# Altium schematic sheet BA-BUS ADDR.SchDoc: DATAPATHS
size A3; Date: .Date; Author: Jeremy King; CompanyName: King Technologies; DrawnBy: Jeremy King; Engineer: Jeremy King; Organization: King Technologies; Address1: 676 Mandan Ave,; Address2: Melbourne,; Address3: FL,; Address4: 32935; DocumentNumber: 1; Revision: 1; SheetNumber: 2; SheetTotal: 3; ProjectTitle: Siena; Time: .Time
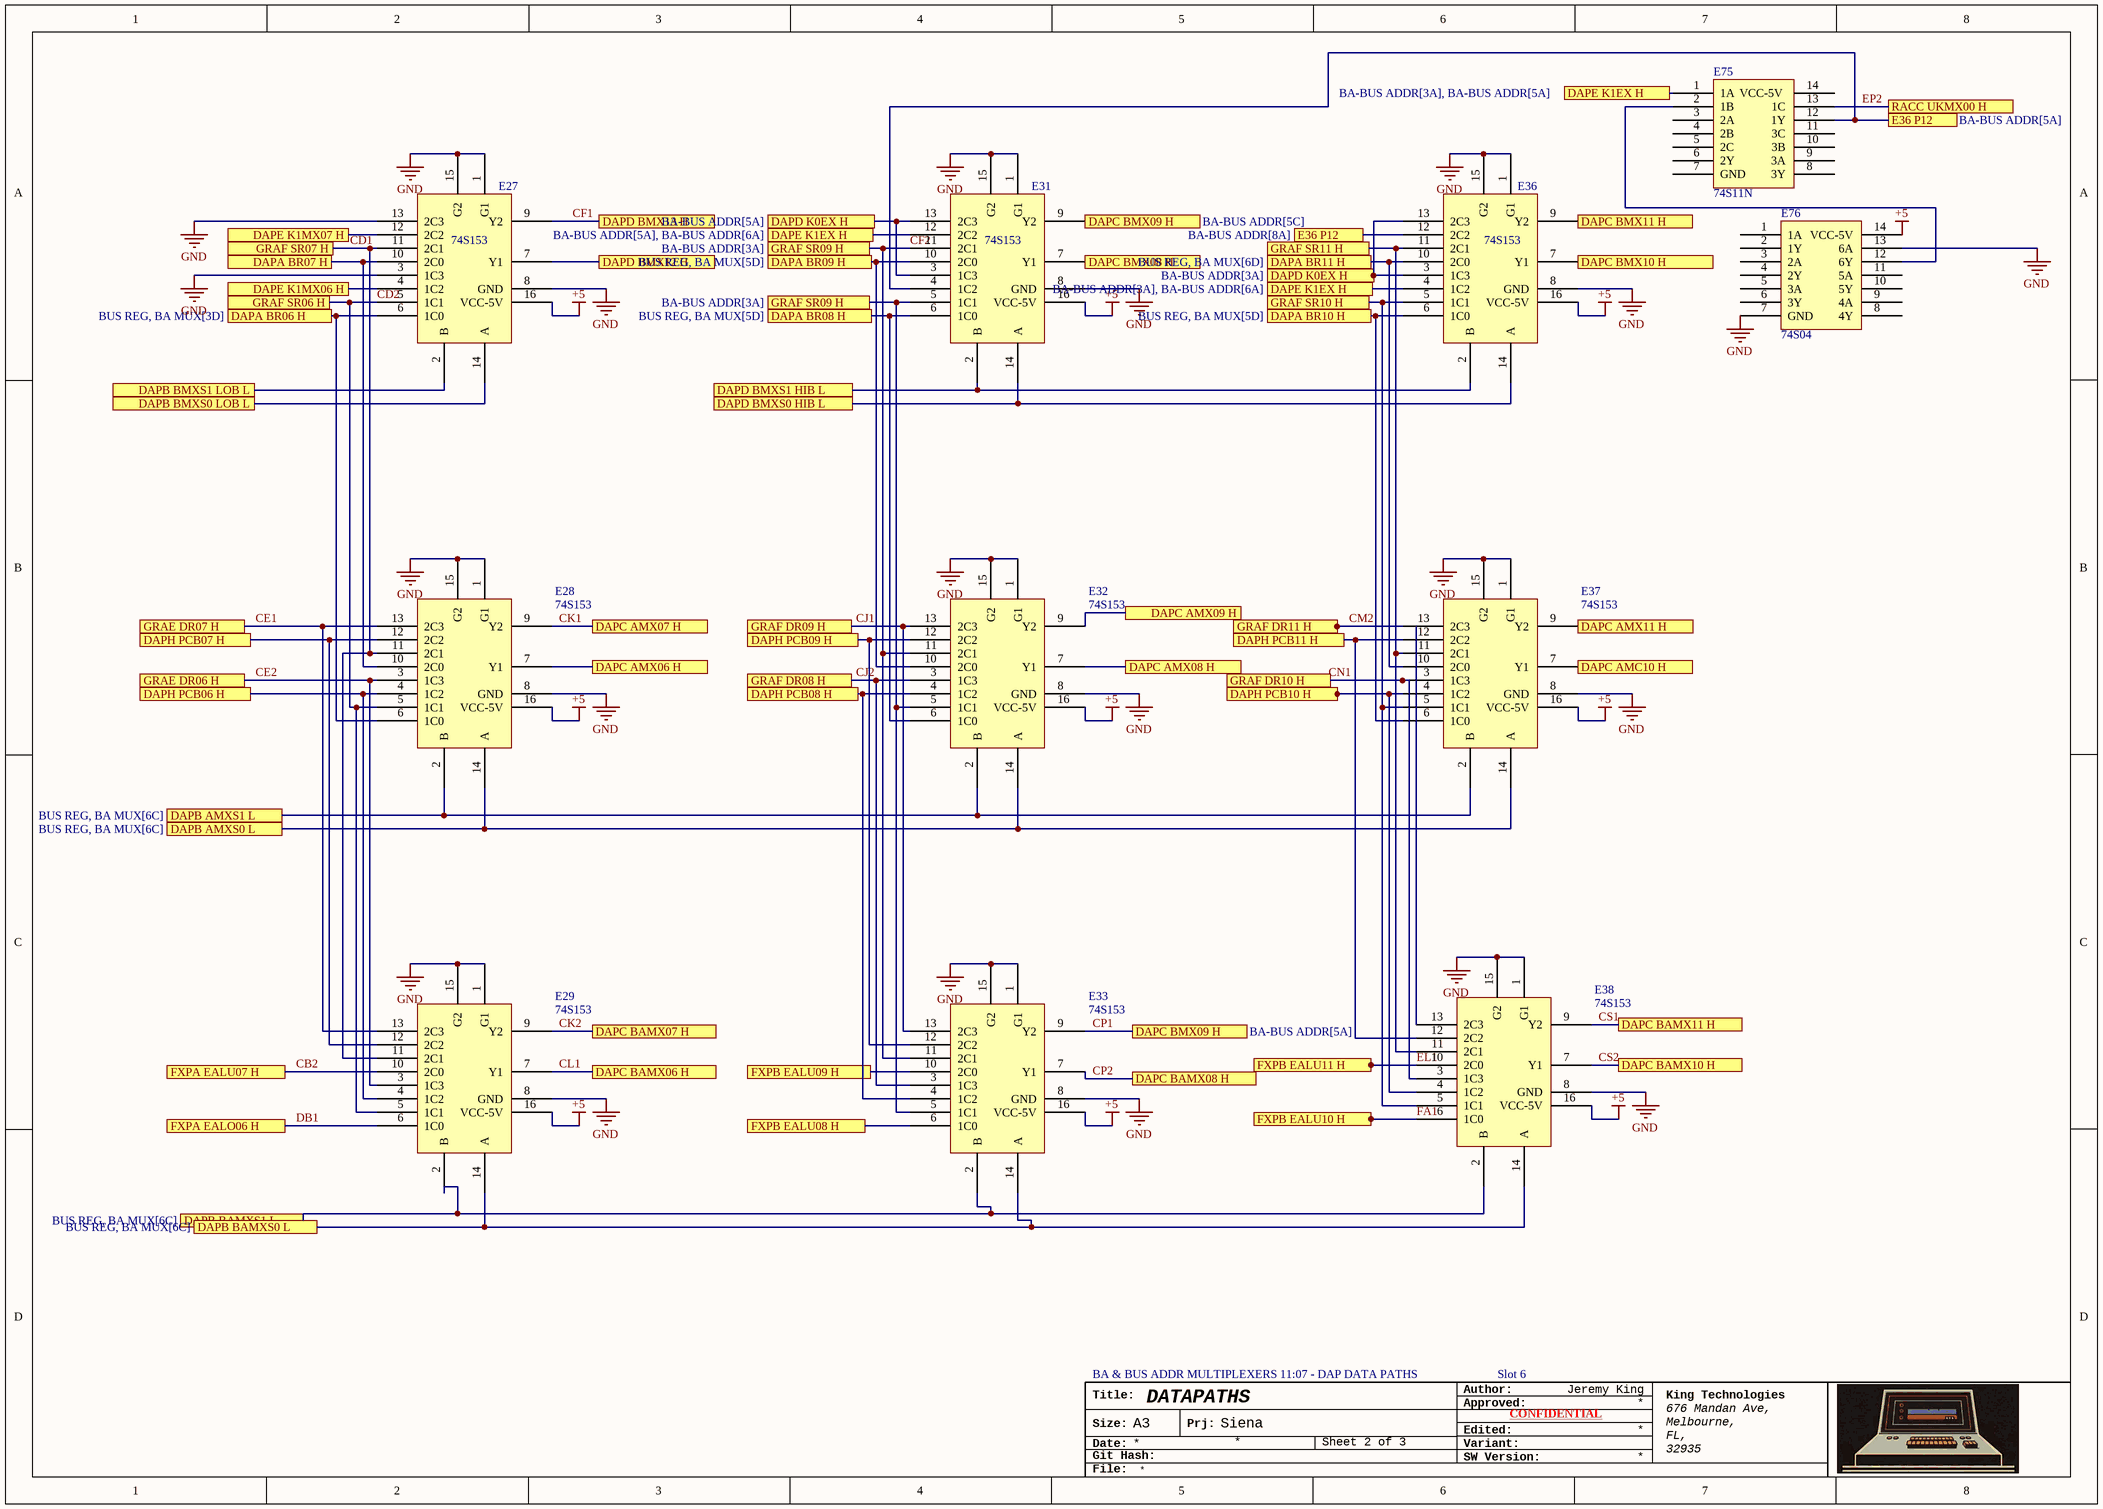
[diagram p0: BA-BUS ADDR.SchDoc]

## Parts
E27  74S153  [DIP16]
E28  74S153  [DIP16]
E29  74S153  [DIP16]
E31  74S153  [DIP16]
E32  74S153  [DIP16]
E33  74S153  [DIP16]
E36  74S153  [DIP16]
E37  74S153  [DIP16]
E38  74S153  [DIP16]
E75  74S11N  [DIP14]
E76  74S04  [DIP14]

## Ports
DAPA BR06 H (see BUS REG, BA MUX[3D]), DAPA BR07 H (see BUS REG, BA MUX[3D]), DAPA BR08 H (see BUS REG, BA MUX[5D]), DAPA BR09 H (see BUS REG, BA MUX[5D]), DAPA BR10 H (see BUS REG, BA MUX[5D]), DAPA BR11 H (see BUS REG, BA MUX[6D]), DAPB AMXS0 L (see BUS REG, BA MUX[6C]), DAPB AMXS1 L (see BUS REG, BA MUX[6C]), DAPB BAMXS0 L (see BUS REG, BA MUX[6C]), DAPB BAMXS1 L (see BUS REG, BA MUX[6C]), DAPB BMXS0 LOB L (see BUS REG, BA MUX[6B]), DAPB BMXS1 LOB L, DAPC AMC10 H, DAPC AMX06 H, DAPC AMX07 H, DAPC AMX08 H, DAPC AMX09 H, DAPC AMX11 H, DAPC BAMX06 H, DAPC BAMX07 H, DAPC BAMX08 H, DAPC BAMX10 H, DAPC BAMX11 H, DAPC BMX08 H, DAPC BMX09 H (see BA-BUS ADDR[5A]), DAPC BMX09 H (see BA-BUS ADDR[5C]), DAPC BMX10 H, DAPC BMX11 H, DAPD BMX12 H, DAPD BMX13 H, DAPD BMXS0 HIB L, DAPD BMXS1 HIB L, DAPD K0EX H (see BA-BUS ADDR[3A]), DAPD K0EX H (see BA-BUS ADDR[5A]), DAPE K1EX H (see BA-BUS ADDR[3A], BA-BUS ADDR[5A]), DAPE K1EX H (see BA-BUS ADDR[3A], BA-BUS ADDR[6A]), DAPE K1EX H (see BA-BUS ADDR[5A], BA-BUS ADDR[6A]), DAPE K1MX06 H, DAPE K1MX07 H, DAPH PCB06 H, DAPH PCB07 H, DAPH PCB08 H, DAPH PCB09 H, DAPH PCB10 H, DAPH PCB11 H, E36 P12 (see BA-BUS ADDR[5A]), E36 P12 (see BA-BUS ADDR[8A]), FXPA EALO06 H, FXPA EALU07 H, FXPB EALU08 H, FXPB EALU09 H, FXPB EALU10 H, FXPB EALU11 H, GRAE DR06 H, GRAE DR07 H, GRAF DR08 H, GRAF DR09 H, GRAF DR10 H, GRAF DR11 H, GRAF SR06 H, GRAF SR07 H, GRAF SR09 H (see BA-BUS ADDR[3A]), GRAF SR10 H, GRAF SR11 H, RACC UKMX00 H

## Nets
+5: E27.16(VCC-5V) E28.16(VCC-5V) E29.16(VCC-5V) E31.16(VCC-5V) E32.16(VCC-5V) E33.16(VCC-5V) E36.16(VCC-5V) E37.16(VCC-5V) E38.16(VCC-5V) E76.14(VCC-5V)
GND: E27.1(G1) E27.3(1C3) E27.8(GND) E27.13(2C3) E27.15(G2) E28.1(G1) E28.8(GND) E28.15(G2) E29.1(G1) E29.8(GND) E29.15(G2) E31.1(G1) E31.8(GND) E31.15(G2) E32.1(G1) E32.8(GND) E32.15(G2) E33.1(G1) E33.8(GND) E33.15(G2) E36.1(G1) E36.8(GND) E36.15(G2) E37.1(G1) E37.8(GND) E37.15(G2) E38.1(G1) E38.8(GND) E38.15(G2) E76.7(GND) E76.13(6A)
CB2: E29.10(2C0) ; port FXPA EALU07 H
CD1: E27.11(2C1) E28.11(2C1) E29.11(2C1) ; port GRAF SR07 H
CD2: E27.5(1C1) E28.5(1C1) E29.5(1C1) ; port GRAF SR06 H
CE1: E28.13(2C3) E29.13(2C3) ; port GRAE DR07 H
CE2: E28.3(1C3) E29.3(1C3) ; port GRAE DR06 H
CF1: E27.9(Y2) ; port DAPD BMX13 H
CF2: E31.5(1C1) E31.11(2C1) E32.5(1C1) E32.11(2C1) E33.5(1C1) E33.11(2C1) ; port GRAF SR09 H
CJ1: E32.13(2C3) E33.13(2C3) ; port GRAF DR09 H
CJ2: E32.3(1C3) E33.3(1C3) ; port GRAF DR08 H
CK1: E28.9(Y2) ; port DAPC AMX07 H
CK2: E29.9(Y2) ; port DAPC BAMX07 H
CL1: E29.7(Y1) ; port DAPC BAMX06 H
CM2: E37.13(2C3) ; port GRAF DR11 H
CP1: E31.9(Y2) E33.9(Y2) ; port DAPC BMX09 H
CP2: E33.7(Y1) ; port DAPC BAMX08 H
CS1: E38.9(Y2) ; port DAPC BAMX11 H
CS2: E38.7(Y1) ; port DAPC BAMX10 H
DAPA BR06 H: E27.6(1C0) E28.6(1C0) ; port DAPA BR06 H
DAPA BR07 H: E27.10(2C0) E28.10(2C0) ; port DAPA BR07 H
DAPA BR08 H: E31.6(1C0) E32.6(1C0) ; port DAPA BR08 H
DAPA BR09 H: E31.10(2C0) E32.10(2C0) ; port DAPA BR09 H
DAPA BR10 H: E36.6(1C0) E37.6(1C0) ; port DAPA BR10 H
DAPA BR11 H: E36.10(2C0) E37.10(2C0) ; port DAPA BR11 H
DAPB AMXS0 L: E28.14(A) E32.14(A) E37.14(A) ; port DAPB AMXS0 L
DAPB AMXS1 L: E28.2(B) E32.2(B) E37.2(B) ; port DAPB AMXS1 L
DAPB BAMXS0 L: E29.14(A) E33.14(A) E38.14(A) ; port DAPB BAMXS0 L
DAPB BAMXS1 L: E29.2(B) E33.2(B) E38.2(B) ; port DAPB BAMXS1 L
DAPB BMXS0 LOB L: E27.14(A) ; port DAPB BMXS0 LOB L
DAPB BMXS1 LOB L: E27.2(B) ; port DAPB BMXS1 LOB L
DAPC AMC10 H: E37.7(Y1) ; port DAPC AMC10 H
DAPC AMX06 H: E28.7(Y1) ; port DAPC AMX06 H
DAPC AMX08 H: E32.7(Y1) ; port DAPC AMX08 H
DAPC AMX09 H: E32.9(Y2) ; port DAPC AMX09 H
DAPC AMX11 H: E37.9(Y2) ; port DAPC AMX11 H
DAPC BMX08 H: E31.7(Y1) ; port DAPC BMX08 H
DAPC BMX10 H: E36.7(Y1) ; port DAPC BMX10 H
DAPC BMX11 H: E36.9(Y2) ; port DAPC BMX11 H
DAPD BMX12 H: E27.7(Y1) ; port DAPD BMX12 H
DAPD BMXS0 HIB L: E31.14(A) E36.14(A) ; port DAPD BMXS0 HIB L
DAPD BMXS1 HIB L: E31.2(B) E36.2(B) ; port DAPD BMXS1 HIB L
DAPD K0EX H: E31.3(1C3) E31.13(2C3) E36.3(1C3) E36.13(2C3) ; port DAPD K0EX H
DAPE K1EX H: E31.12(2C2) E36.4(1C2) E75.1(1A) ; port DAPE K1EX H
DAPE K1MX06 H: E27.4(1C2) ; port DAPE K1MX06 H
DAPE K1MX07 H: E27.12(2C2) ; port DAPE K1MX07 H
DAPH PCB06 H: E28.4(1C2) E29.4(1C2) ; port DAPH PCB06 H
DAPH PCB07 H: E28.12(2C2) E29.12(2C2) ; port DAPH PCB07 H
DAPH PCB08 H: E32.4(1C2) E33.4(1C2) ; port DAPH PCB08 H
DAPH PCB09 H: E32.12(2C2) E33.12(2C2) ; port DAPH PCB09 H
DAPH PCB10 H: E37.4(1C2) E38.4(1C2) ; port DAPH PCB10 H
DAPH PCB11 H: E37.12(2C2) E38.12(2C2) ; port DAPH PCB11 H
DB1: E29.6(1C0) ; port FXPA EALO06 H
E36 P12: E31.4(1C2) E36.12(2C2) E75.12(1Y) ; port E36 P12
EL1: E38.10(2C0) ; port FXPB EALU11 H
EP2: E75.13(1C) ; port RACC UKMX00 H
FA1: E38.6(1C0) ; port FXPB EALU10 H
FXPB EALU08 H: E33.6(1C0) ; port FXPB EALU08 H
FXPB EALU09 H: E33.10(2C0) ; port FXPB EALU09 H
GRAF DR10 H: E37.3(1C3) E38.3(1C3) ; port GRAF DR10 H
GRAF SR10 H: E36.5(1C1) E37.5(1C1) E38.5(1C1) ; port GRAF SR10 H
GRAF SR11 H: E36.11(2C1) E37.11(2C1) E38.11(2C1) ; port GRAF SR11 H
NetE75_2: E75.2(1B) E76.12(6Y)

Not connected (* = marked no-connect by the designer): E38 13(2C3); E75 3(2A) 4(2B) 5(2C) 6(2Y) 7(GND) 8(3Y) 9(3A) 10(3B) 11(3C) 14(VCC-5V_); E76 1(1A) 2(1Y) 3(2A) 4(2Y) 5(3A) 6(3Y) 8(4Y) 9(4A) 10(5Y) 11(5A)

## Notes on the sheet
- BA & BUS ADDR MULTIPLEXERS 11:07 - DAP DATA PATHS
- Slot 6
- Labels drawn without touching a wire or pin: CN1
- Title:
- Author:
- Approved:
- Size:
- Date:
- Git Hash:
- A3
- Prj:
- SW Version:
- Variant:
- Edited:
- CONFIDENTIAL
- File:

## Library data of the parts
E27-E29 E31-E33 E36-E38 = 74S153: Supplier 1: Rochester Electronics; Supplier Part Number 1: DM74S153N
E75 = 74S11N: Supplier 1: Rochester Electronics; Supplier Part Number 1: SN74S11N
E76 = 74S04: Supplier 1: Mouser; Supplier Part Number 1: 595-SN74S04N